# EAGLE design Robotic Arm (EAGLE 9.0.1)
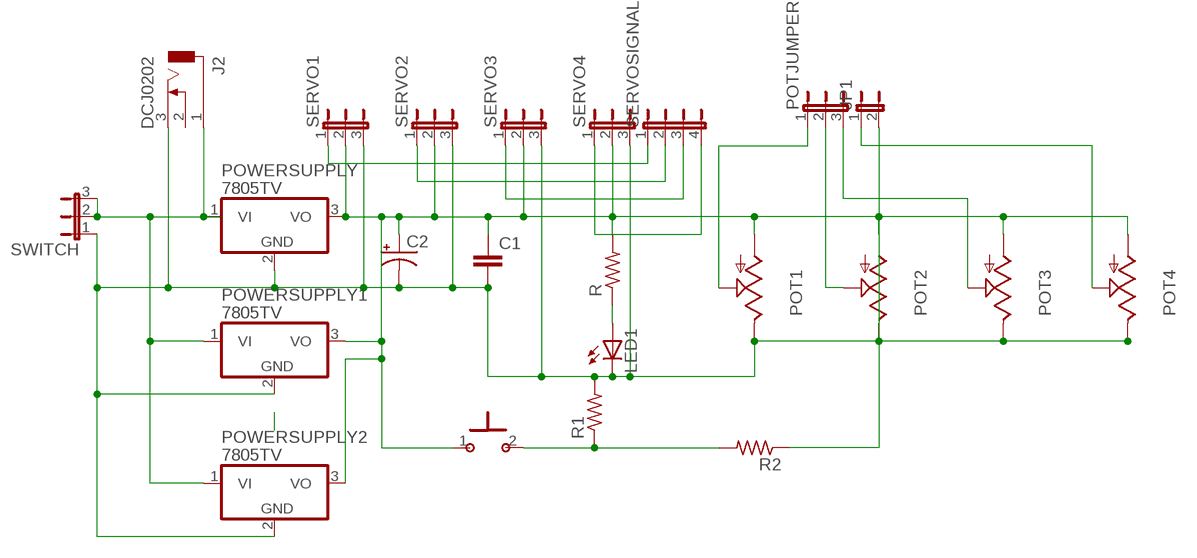
[diagram p0: schematic, sheet 1]

## Parts
C1  C-EU050-025X075  [C050-025X075]
C2  CPOL-USE3.5-8  [E3,5-8]
J2  DCJ0202  [DCJ0202]
JP1  JP1E  [JP1]
LED1  LED5MM  [LED5MM]
POT1  TRIM_US-B25P  [B25P]
POT2  TRIM_US-B25P  [B25P]
POT3  TRIM_US-B25P  [B25P]
POT4  TRIM_US-B25P  [B25P]
POTJUMPER  JP2E  [JP2]
POWERSUPPLY  7805TV  [TO220V]
POWERSUPPLY1  7805TV  [TO220V]
POWERSUPPLY2  7805TV  [TO220V]
R  R-US_0207/10  [0207/10]
R1  R-US_0207/10  [0207/10]
R2  R-US_0207/10  [0207/10]
SERVO1  JP2E  [JP2]
SERVO2  JP2E  [JP2]
SERVO3  JP2E  [JP2]
SERVO4  JP2E  [JP2]
SERVOSIGNAL  JP4E  [JP4]
SWITCH  JP2E  [JP2]
U$1  PUSHBUTTON  [PUSHBUTTON]

## Nets
N$1: C1.2 C2.- J2.3 LED1.K(C) POT1.E POT2.E POT3.E POT4.E POWERSUPPLY1.2(GND) POWERSUPPLY2.2(GND) POWERSUPPLY.2(GND) R1.2 SERVO1.3 SERVO2.3 SERVO3.3 SERVO4.3 SWITCH.1
N$2: C1.1 C2.+ POT1.A POT2.A POT3.A POT4.A POWERSUPPLY1.3(VO) POWERSUPPLY2.3(VO) POWERSUPPLY.3(VO) R.2 SERVO1.2 SERVO2.2 SERVO3.2 SERVO4.2 U$1.1
N$3: LED1.A R.1
N$4: J2.1 POWERSUPPLY1.1(VI) POWERSUPPLY2.1(VI) POWERSUPPLY.1(VI) SWITCH.2 SWITCH.3
N$5: POT1.S POTJUMPER.1
N$6: POT2.S POTJUMPER.2
N$8: JP1.1 POT4.S
N$9: SERVO1.1 SERVOSIGNAL.1
N$10: SERVO2.1 SERVOSIGNAL.2
N$11: SERVO3.1 SERVOSIGNAL.3
N$12: SERVO4.1 SERVOSIGNAL.4
N$13: POT3.S POTJUMPER.3
N$14: R1.1 R2.2 U$1.2
N$15: JP1.2 R2.1
Unconnected: J2.2

## Library data of the parts
C1 = rcl:C-EU: CAPACITOR, European symbol; SPICEPREFIX: C
C2 = rcl:CPOL-US: POLARIZED CAPACITOR, American symbol; SPICEPREFIX: C
J2 = con-jack:DCJ0202: DC POWER JACK Source: DCJ0202.pdf; OC_FARNELL: unknown; OC_NEWARK: unknown
JP1 = jumper:JP1E: JUMPER
LED1 = led:LED: LED OSRAM: - CHIPLED LG R971, LG N971, LY N971, LG Q971, LY Q971, LO R971, LY R971 LH N974, LH R974 LS Q976, LO Q976, LY Q976 LO Q996 - Hyper CHIPLED LW Q18S LB Q993, LB Q99A, LB R99A - SideLED LS A670, LO A670, LY A670, LG A670, LP A670 LB A673, LV A673, LT A673, LW A673 LH A674 LY A675 LS A676, LA A676, LO A676, LY A676, LW A676 LS A679, LY A679, LG A679 - Hyper Micro SIDELED® LS Y876, LA Y876, LO Y876, LY Y876 LT Y87S - SmartLED LW L88C, LW L88S LB L89C, LB L89S, LG L890 LS L89K, LO L89K, LY L89K LS L896, LA L896, LO L896, LY L896 - TOPLED LS T670, LO T670, LY T670, LG T670, LP T670 LSG T670, LSP T670, LSY T670, LOP T670, LYG T670 LG T671, LOG T671, LSG T671 LB T673, LV T673, LT T673, LW T673 LH T674 LS T676, LA T676, LO T676, LY T676, LB T676, LH T676, LSB T676, LW T676 LB T67C, LV T67C, LT T67C, LS T67K, LO T67K, LY T67K, LW E67C LS E67B, LA E67B, LO E67B, LY E67B, LB E67C, LV E67C, LT E67C LW T67C LS T679, LY T679, LG T679 LS T770, LO T770, LY T770, LG T770, LP T770 LB T773, LV T773, LT T773, LW T773 LH T774 LS E675, LA E675, LY E675, LS T675 LS T776, LA T776, LO T776, LY T776, LB T776 LHGB T686 LT T68C, LB T68C - Hyper Mini TOPLED® LB M676 - Mini TOPLED Santana® LG M470 LS M47K, LO M47K, LY M47K Source: http://www.osram.convergy.de LUXEON: - LUMILED® LXK2-PW12-R00, LXK2-PW12-S00, LXK2-PW14-U00, LXK2-PW14-V00 LXK2-PM12-R00, LXK2-PM12-S00, LXK2-PM14-U00 LXK2-PE12-Q00, LXK2-PE12-R00, LXK2-PE12-S00, LXK2-PE14-T00, LXK2-PE14-U00 LXK2-PB12-K00, LXK2-PB12-L00, LXK2-PB12-M00, LXK2-PB14-N00, LXK2-PB14-P00, LXK2-PB14-Q00 LXK2-PR12-L00, LXK2-PR12-M00, LXK2-PR14-Q00, LXK2-PR14-R00 LXK2-PD12-Q00, LXK2-PD12-R00, LXK2-PD12-S00 LXK2-PH12-R00, LXK2-PH12-S00 LXK2-PL12-P00, LXK2-PL12-Q00, LXK2-PL12-R00 Source: www.luxeon.com KINGBRIGHT: KA-3528ASYC Source: www.kingbright.com
POT1-POT4 = pot:TRIM_US-: POTENTIOMETER
POTJUMPER SERVO1-SERVO4 SWITCH = jumper:JP2E: JUMPER
POWERSUPPLY POWERSUPPLY1 POWERSUPPLY2 = linear:78*: Positive VOLTAGE REGULATOR Source: http://cache.national.com/ds/LM/LM78L05.pdf http://www.fairchildsemi.com/ds/LM/LM7805.pdf
R R1 R2 = rcl:R-US_: RESISTOR, American symbol; SPICEPREFIX: R
SERVOSIGNAL = jumper:JP4E: JUMPER
U$1 = TEJ4M1:PUSHBUTTON: Pushbutton

## Board
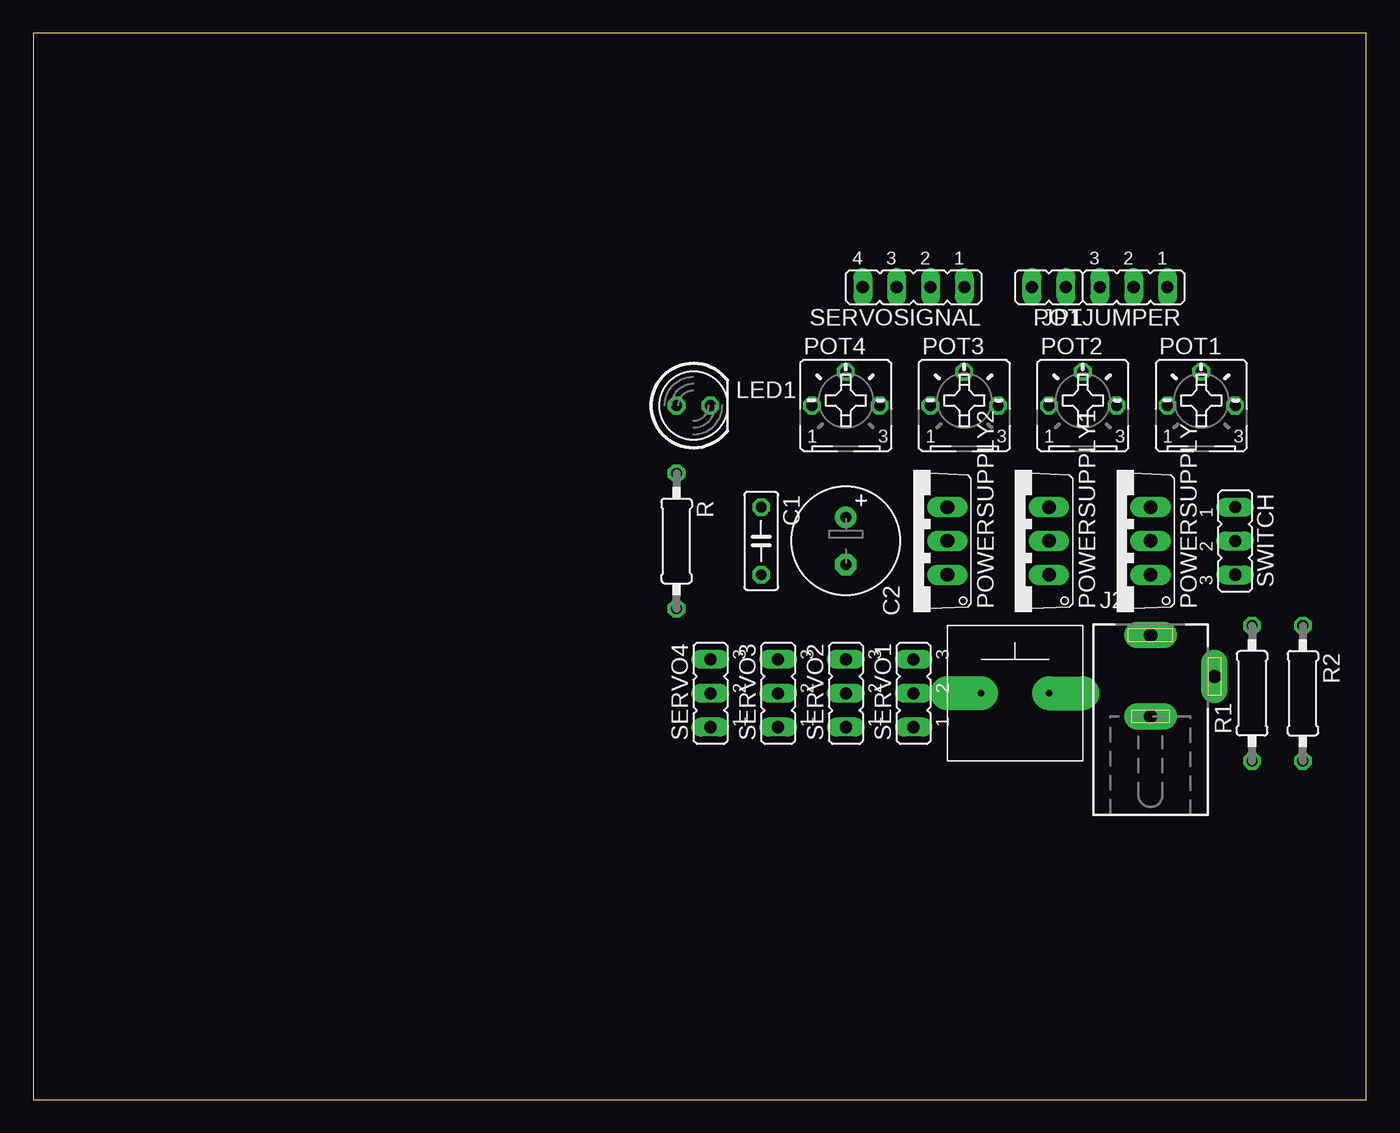
[diagram p1: board, top side]
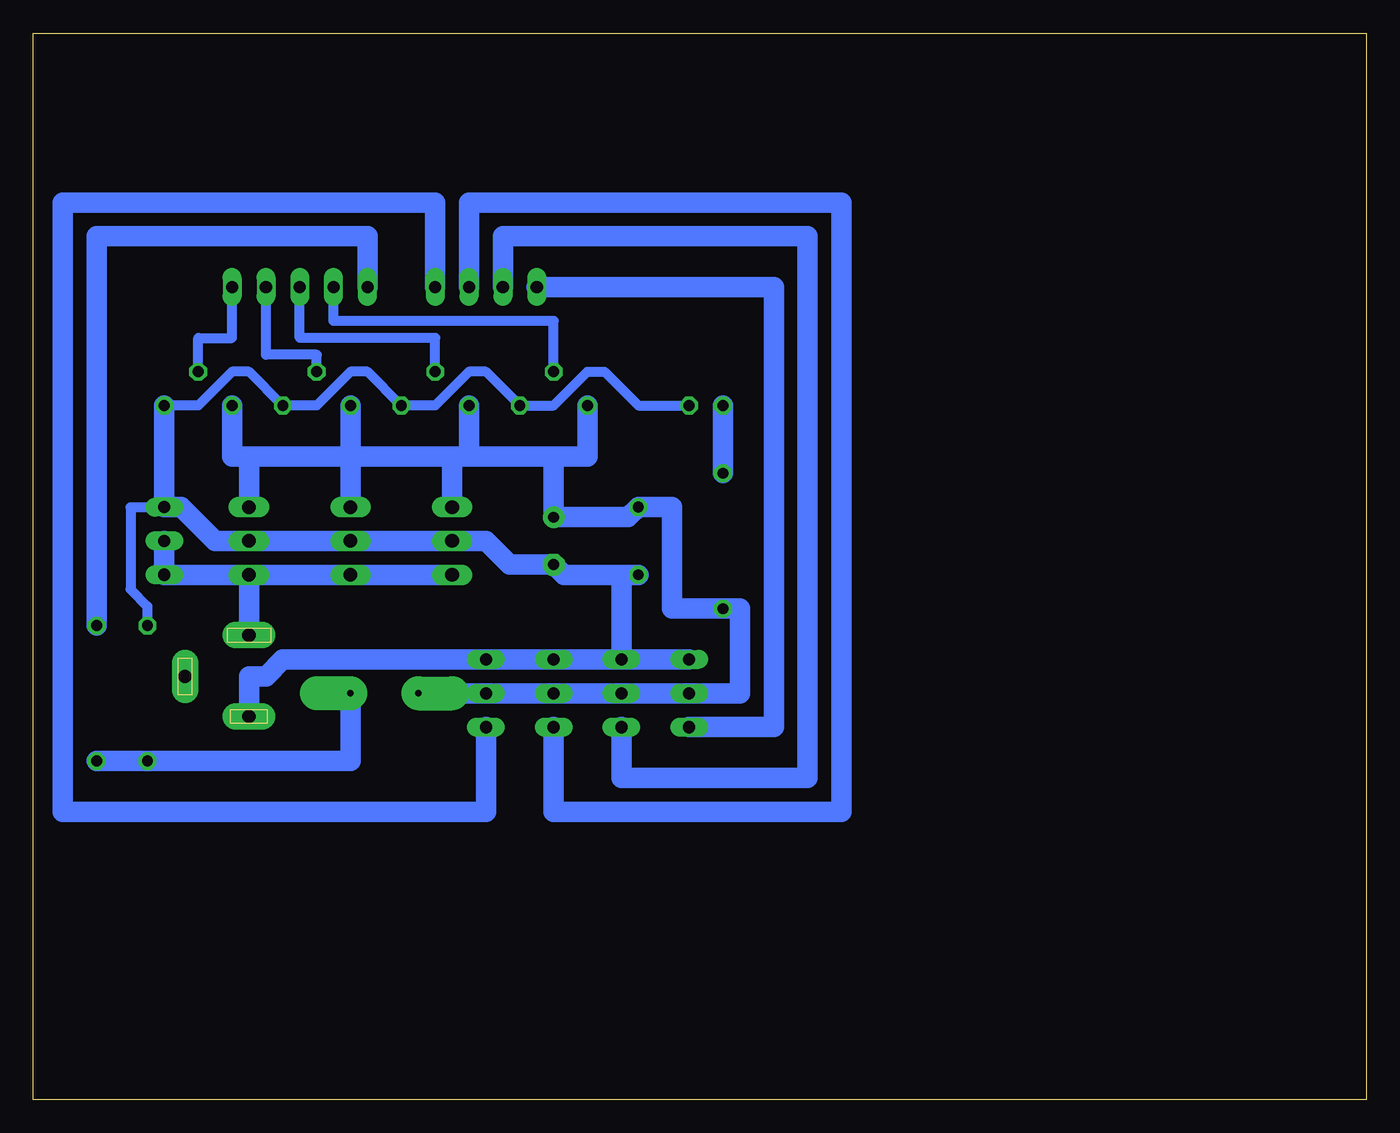
[diagram p2: board, bottom side, seen from below]

Size 100 x 80 mm. Coordinates in mm from the lower left corner, seen from the top.
Outline: 0,0 100,0 100,80 0,80 0,0
Copper layers (1*16): Top 0.035mm / dielectric 1.5mm / Bottom 0.035mm
Design rules "default *": minimum track width 6mil, minimum drill 0.35mm, track to track 6mil, track to pad 6mil, pad to pad 6mil, via to via 6mil, smd to smd 6mil, copper to edge 40mil, drill to drill 6mil, minimum pad ring 10mil, minimum via ring 8mil, stop-mask expansion 4mil, vias tented up to drill 0mil, thermal gap 10mil

### Footprints (pad centres in the part's own frame; a part is rotated, then mirrored left to right if it is on the bottom)
C050-025X075 = drill 0.813 octagon: 1 -2.54,0; 2 2.54,0
E3,5-8 = drill 0.813 pad 1.6: + -1.778,0 | drill 0.813 pad 1.6 octagon: - 1.778,0
DCJ0202 = drill 1 pad 2 long: 1 0,3.1; 2 4.8,0; 3 0,-3
JP1 = drill 0.914 long: 1 0,-1.27; 2 0,1.27
LED5MM = drill 0.813 octagon: A -1.27,0; K 1.27,0
B25P = drill 0.813 octagon: A -2.54,0; E 2.54,0; S 0,2.54
JP2 = drill 0.914 long: 1 -2.54,0; 2 0,0; 3 2.54,0
TO220V = drill 1.016 long: 1 -2.54,-2.54; 2 0,-2.54; 3 2.54,-2.54
0207/10 = drill 0.813 octagon: 1 -5.08,0; 2 5.08,0
JP4 = drill 0.914 long: 1 -3.81,0; 2 -1.27,0; 3 1.27,0; 4 3.81,0
PUSHBUTTON = drill 0.5 pad 2.54 offset: 1 -2.54,0; 2 2.54,0

### Placement (x,y rotation side)
C1  54.61,41.91 270 top
C2  60.96,41.91 270 top
J2  83.82,31.75 0 top
JP1  76.2,60.96 90 top
LED1  49.53,52.07 0 top
POT1  87.63,52.07 0 top
POT2  78.74,52.07 0 top
POT3  69.85,52.07 0 top
POT4  60.96,52.07 0 top
POTJUMPER  82.55,60.96 180 top
POWERSUPPLY  81.28,41.91 90 top
POWERSUPPLY1  73.66,41.91 90 top
POWERSUPPLY2  66.04,41.91 90 top
R  48.26,41.91 270 top
R1  91.44,30.48 90 top
R2  95.25,30.48 270 top
SERVO1  66.04,30.48 90 top
SERVO2  60.96,30.48 90 top
SERVO3  55.88,30.48 90 top
SERVO4  50.8,30.48 90 top
SERVOSIGNAL  66.04,60.96 180 top
SWITCH  90.17,41.91 270 top
U$1  73.66,30.48 0 top

### Tracks (layer width: path | path; a pad name or v marks a point on that pad's centre or on a via)
N$1
  Bottom 0.762: SWITCH.1 92.71,44.45 92.71,38.28 91.44,37.01 R1.2 | POT1.E 87.63,52.07 85.09,54.61 83.82,54.61 POT2.E 78.74,52.07 76.2,54.61 74.93,54.61 POT3.E 69.85,52.07 67.31,54.61 66.04,54.61 POT4.E 60.96,52.07 58.42,54.61 57.15,54.61 54.61,52.07 LED1.K
  Bottom 1.524: SERVO4.3 SERVO3.3 | SERVO3.3 SERVO2.3 SERVO1.3 81.28,33.02 82.55,31.75 83.82,31.75 J2.3 | POT1.E SWITCH.1 88.9,44.45 86.36,41.91 POWERSUPPLY.2 POWERSUPPLY1.2 POWERSUPPLY2.2 66.04,41.91 64.26,40.13 C2.- 60.2,39.37 55.88,39.37 | C1.2 55.88,39.37 | SERVO3.3 55.88,39.37
N$2
  Bottom 1.524: U$1.1 SERVO1.2 SERVO2.2 SERVO3.2 SERVO4.2 46.99,30.48 46.99,36.83 R.2 52.07,36.83 52.07,44.45 C1.1 55.37,43.69 C2.+ 60.96,48.26 | POWERSUPPLY.3 83.82,48.26 | 83.82,48.26 76.2,48.26 | 76.2,48.26 68.58,48.26 | 68.58,48.26 67.31,48.26 | 67.31,48.26 60.96,48.26 | 60.96,48.26 58.42,48.26 POT4.A | POT3.A 67.31,48.26 | POT2.A 76.2,48.26 | POT1.A 85.09,48.26 83.82,48.26 | POWERSUPPLY1.3 76.2,48.26 | POWERSUPPLY2.3 68.58,48.26
N$3
  Bottom 1.524: R.1 LED1.A
N$4
  Bottom 1.524: SWITCH.2 SWITCH.3 POWERSUPPLY.1 | POWERSUPPLY.1 POWERSUPPLY1.1 POWERSUPPLY2.1 | J2.1 POWERSUPPLY.1
N$5
  Bottom 0.762: POT1.S 87.63,57.15 85.09,57.15 POTJUMPER.1
N$6
  Bottom 0.762: POT2.S 78.74,55.88 82.55,55.88 POTJUMPER.2
N$8
  Bottom 0.762: POT4.S 60.96,58.42 77.47,58.42 JP1.1
N$9
  Bottom 1.524: SERVOSIGNAL.1 69.85,67.31 97.79,67.31 97.79,21.59 66.04,21.59 SERVO1.1
N$10
  Bottom 1.524: SERVO2.1 60.96,21.59 39.37,21.59 39.37,67.31 67.31,67.31 SERVOSIGNAL.2
N$11
  Bottom 1.524: SERVOSIGNAL.3 64.77,64.77 41.91,64.77 41.91,24.13 55.88,24.13 SERVO3.1
N$12
  Bottom 1.524: SERVOSIGNAL.4 44.45,60.96 44.45,27.94 SERVO4.1
N$13
  Bottom 0.762: POT3.S 69.85,57.15 80.01,57.15 POTJUMPER.3
N$14
  Bottom 1.524: U$1.2 76.2,25.4 R1.1 R2.2
N$15
  Bottom 1.524: R2.1 95.25,64.77 74.93,64.77 JP1.2